# EAGLE design power (EAGLE 5.11)
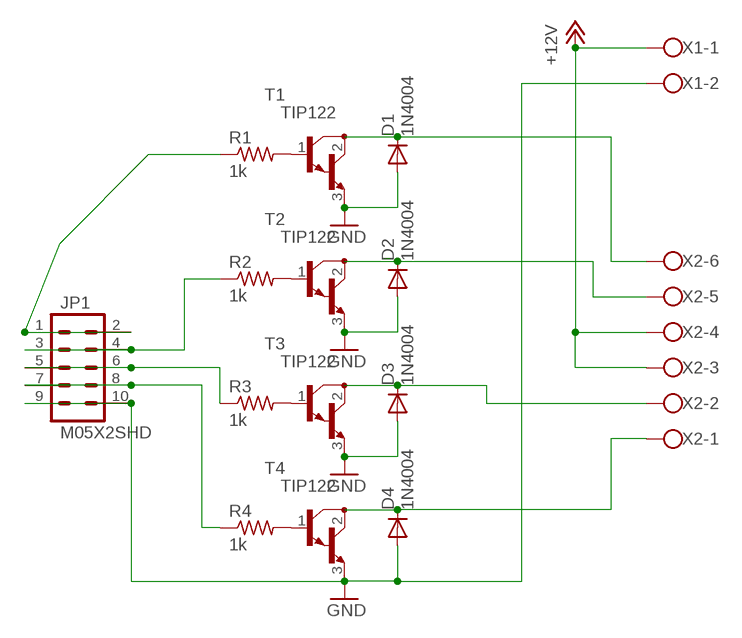
[diagram p0: schematic, sheet 1]

## Parts
D1  1N4004  [DO41-10]
D2  1N4004  [DO41-10]
D3  1N4004  [DO41-10]
D4  1N4004  [DO41-10]
JP1  M05X2SHD  [2X5-SHROUDED]
R1  1k  R-US_0204/5  [0204/5]
R2  1k  R-US_0204/5  [0204/5]
R3  1k  R-US_0204/5  [0204/5]
R4  1k  R-US_0204/5  [0204/5]
T1  TIP122  [TO220]
T2  TIP122  [TO220]
T3  TIP122  [TO220]
T4  TIP122  [TO220]
X1  W237-102  [W237-102]
X2  W237-136  [W237-136]

## Nets
+12V: X1.1 X2.3 X2.4
GND: D1.A D2.A D3.A D4.A JP1.9 JP1.10 T1.3(E) T2.3(E) T3.3(E) T4.3(E) X1.2
N$1: R1.2 T1.1(B)
N$2: R2.2 T2.1(B)
N$3: R3.2 T3.1(B)
N$4: R4.2 T4.1(B)
N$5: D1.C T1.2(C) X2.6
N$6: D2.C T2.2(C) X2.5
N$7: D3.C T3.2(C) X2.2
N$8: D4.C T4.2(C) X2.1
N$10: JP1.1 JP1.2 R1.1
N$11: JP1.3 JP1.4 R2.1
N$12: JP1.5 JP1.6 R3.1
N$13: JP1.7 JP1.8 R4.1

## Library data of the parts
D1-D4 = diode:1N4004: DIODE general purpose rectifier, 1 A
JP1 = 3d2011:M05X2: Header 5x2 Standard 10-pin dual row 0.1" header. Commonly used with AVR-ISP. Use with Spark Fun Electronics SKU: PRT-00778
R1-R4 = rcl:R-US_: RESISTOR, American symbol
T1-T4 = transistor:TIP122: NPN BIPOLAR DARLINGTON TRANSISTOR
X1 = con-wago-500:W237-102: WAGO SCREW CLAMP; MPN: 237-102; OC_FARNELL: unknown; OC_NEWARK: 70K9898
X2 = con-wago-500:W237-136: WAGO SCREW CLAMP; MPN: 237-136; OC_FARNELL: unknown; OC_NEWARK: 84K9151

## Board
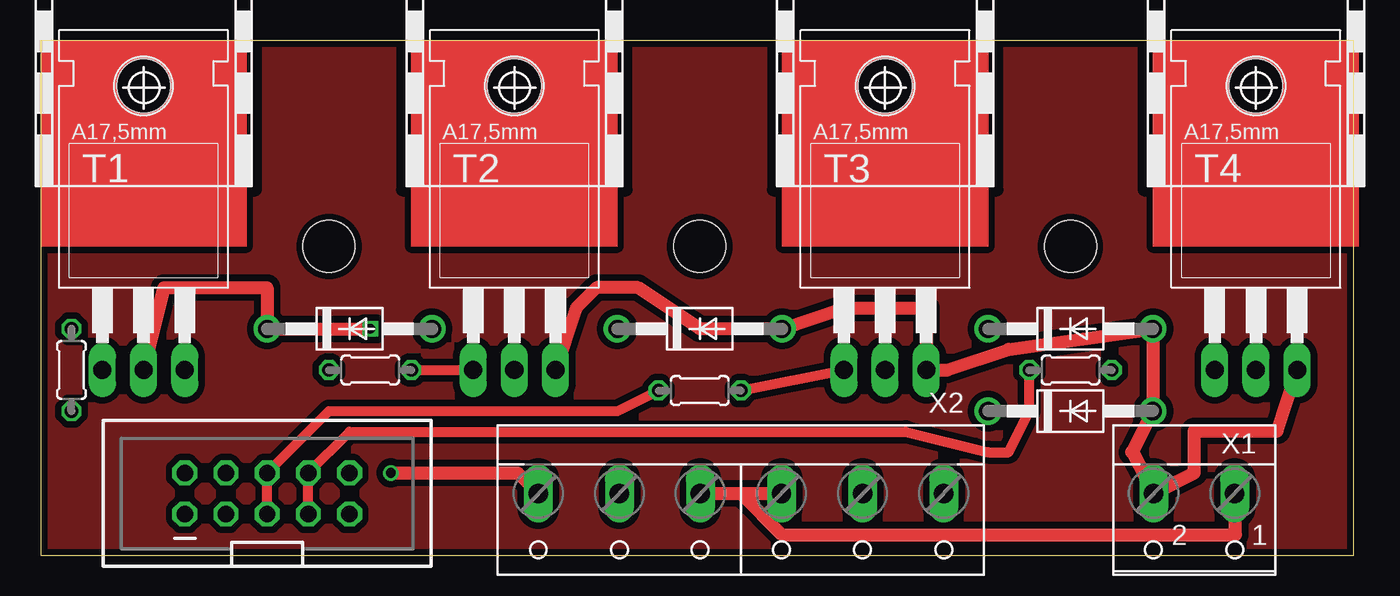
[diagram p1: board, top side]
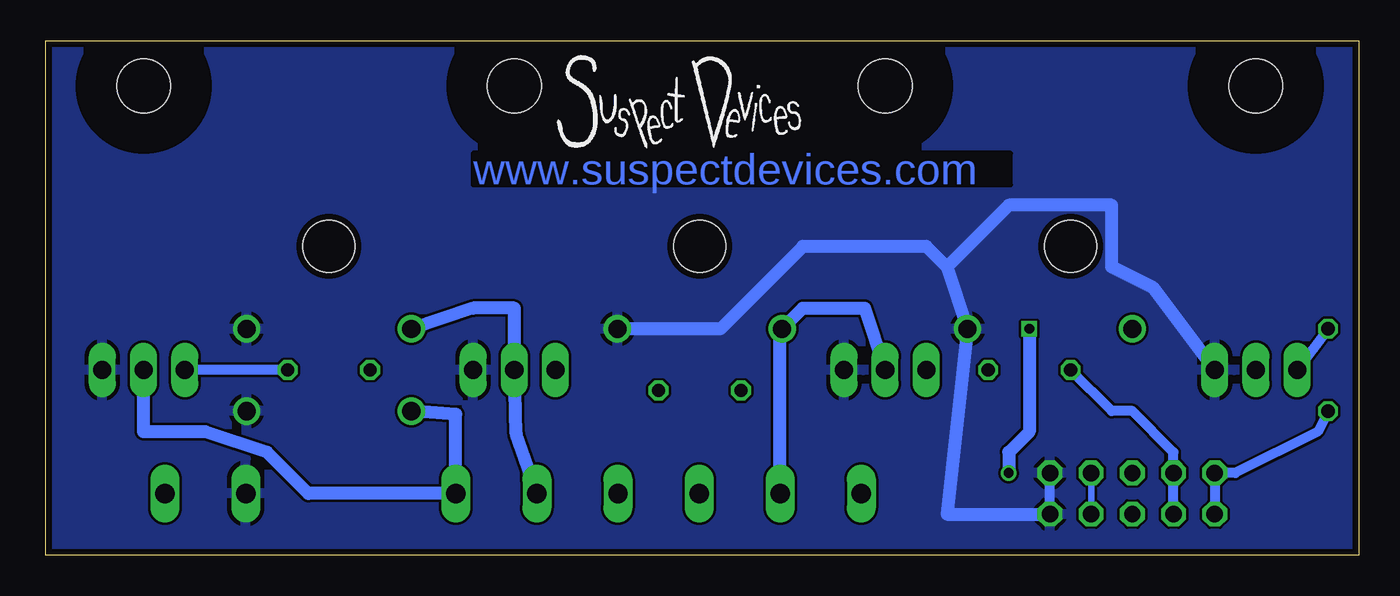
[diagram p2: board, bottom side, seen from below]

Size 80.95 x 31.74 mm. Coordinates in mm from the lower left corner, seen from the top.
Outline: 0,0 80.95,0 80.95,31.74 0,31.74 0,0
Copper layers (1*16): Top 0.0356mm / dielectric 1.5011mm / Bottom 0.0356mm
Design rules "LaenPCBOrder": minimum track width 6mil, minimum drill 13mil, track to track 6mil, track to pad 6mil, pad to pad 6mil, via to via 6mil, smd to smd 6mil, copper to edge 15mil, drill to drill 6mil, minimum pad ring 7mil, minimum via ring 7mil, stop-mask expansion 4mil, vias tented up to drill 0mil, thermal gap 10mil
Holes 3.2 mm at 17.78,19.05 40.64,19.05 63.5,19.05

### Footprints (pad centres in the part's own frame; a part is rotated, then mirrored left to right if it is on the bottom)
DO41-10 = drill 1.118 round: A 5.08,0; C -5.08,0
2X5-SHROUDED = drill 1.016 octagon: 1 -1.27,5.08; 2 1.27,5.08; 3 -1.27,2.54; 4 1.27,2.54; 5 -1.27,0; 6 1.27,0; 7 -1.27,-2.54; 8 1.27,-2.54; 9 -1.27,-5.08; 10 1.27,-5.08
0204/5 = drill 0.813 octagon: 1 -2.54,0; 2 2.54,0
TO220 = drill 1.118 long: 1 -2.54,-6.35; 2 0,-6.35; 3 2.54,-6.35 | hole 3.302: 0,11.176
W237-102 = drill 1.194 long: 1 -2.5,-1.27; 2 2.5,-1.27
W237-136 = drill 1.194 long: 1 -12.5,-1.27; 2 -7.5,-1.27; 3 -2.5,-1.27; 4 2.5,-1.27; 5 7.5,-1.27; 6 12.5,-1.27

### Placement (x,y rotation side)
D1  19.05,13.97 0 top
D2  40.64,13.97 0 top
D3  63.5,13.97 0 top
D4  63.5,8.89 0 top
JP1  13.97,3.81 90 top
R1  1.91,11.43 90 top
R2  20.32,11.43 0 top
R3  40.64,10.16 0 top
R4  63.5,11.43 0 top
T1  6.35,17.78 0 top
T2  29.21,17.78 0 top
T3  52.07,17.78 0 top
T4  74.93,17.78 0 top
U$1  [D02A-L]  29.21,34.29 90 top
U$2  [D02A-L]  6.35,34.29 90 top
U$3  [D02A-L]  52.07,34.29 90 top
U$4  [D02A-L]  74.93,34.29 90 top
U$5  [SUSDEVLOGOSM]  49.53,25.4 0 bottom
X1  71.12,2.54 180 top
X2  43.18,2.54 180 top

### Tracks (layer width: path | path; a pad name or v marks a point on that pad's centre or on a via)
+12V
  Top 0.813: X2.3 X2.4 43.18,3.81 45.72,1.27 73.66,1.27 73.66,3.77 X1.1
GND
  Top 0.813: T4.3 76.24,7.66 71.12,7.66 71.12,5.08 X1.2 67.31,6.39 | 67.31,6.39 D4.A D3.A 59.69,12.7 55.88,11.43 T3.3 54.61,15.24 49.53,15.24 D2.A 40.64,13.97 36.83,16.51 34.29,16.51 33.02,15.24 T2.3 | 67.31,6.39 67.27,6.35
  Bottom 0.61: JP1.9 JP1.10
  Bottom 0.813: 25.4,17.78 D1.A 25.4,2.54 JP1.9 | 25.4,17.78 21.59,21.59 15.24,21.59 15.24,20.32 15.24,17.78 12.7,16.51 T1.3 | 25.4,17.78 26.67,19.05 34.29,19.05 39.37,13.97 D2.A
  pour Bottom: 0,31.75 81.28,31.75 81.28,0 0,0
N$1
  Bottom 0.61: R1.2 T1.1
N$2
  Top 0.61: R2.2 T2.1
N$3
  Top 0.61: R3.2 T3.1
N$4
  Bottom 0.61: R4.2 T4.1
N$5  (via drill 0.6)
  Top 0.813: T1.2 7.62,16.51 13.97,16.51 D1.C v20.32,13.97 | v21.59,5.08 29.41,5.08 X2.6
  Bottom 0.813: v20.32,13.97 20.32,7.62 21.59,6.35 v21.59,5.08
N$6
  Bottom 0.813: X2.5 35.68,13.85 D2.C 34.29,15.24 30.48,15.24 T2.2
N$7
  Bottom 0.813: X2.2 51.95,7.5 T3.2 52.07,15.24 54.61,15.24 D3.C
N$8
  Bottom 0.813: T4.2 74.93,7.62 71.12,7.62 67.31,6.35 64.77,3.81 X2.1 55.68,8.69 D4.C
N$9
  pour Top (isolate 0.406): 0,0 81.28,0 81.28,31.75 0,31.75
N$10
  Bottom 0.61: R1.1 2.54,7.62 7.62,5.08 JP1.2 JP1.1
N$11
  Bottom 0.61: JP1.3 JP1.4 11.43,6.35 13.97,8.89 15.24,8.89 R2.1
N$12
  Top 0.61: R3.1 35.56,8.89 17.78,8.89 JP1.6 JP1.5
N$13
  Top 0.61: JP1.7 JP1.8 19.05,7.62 53.34,7.62 58.42,6.35 59.69,6.35 60.96,8.89 R4.1
  Bottom 0.406: JP1.7 JP1.8
(copper drawn outside any net)
  shapes: Top area x4

### Text on the board
Bottom: www.suspectdevices.com